# EAGLE design Wino_Adapter_1 (EAGLE 7.5.0)
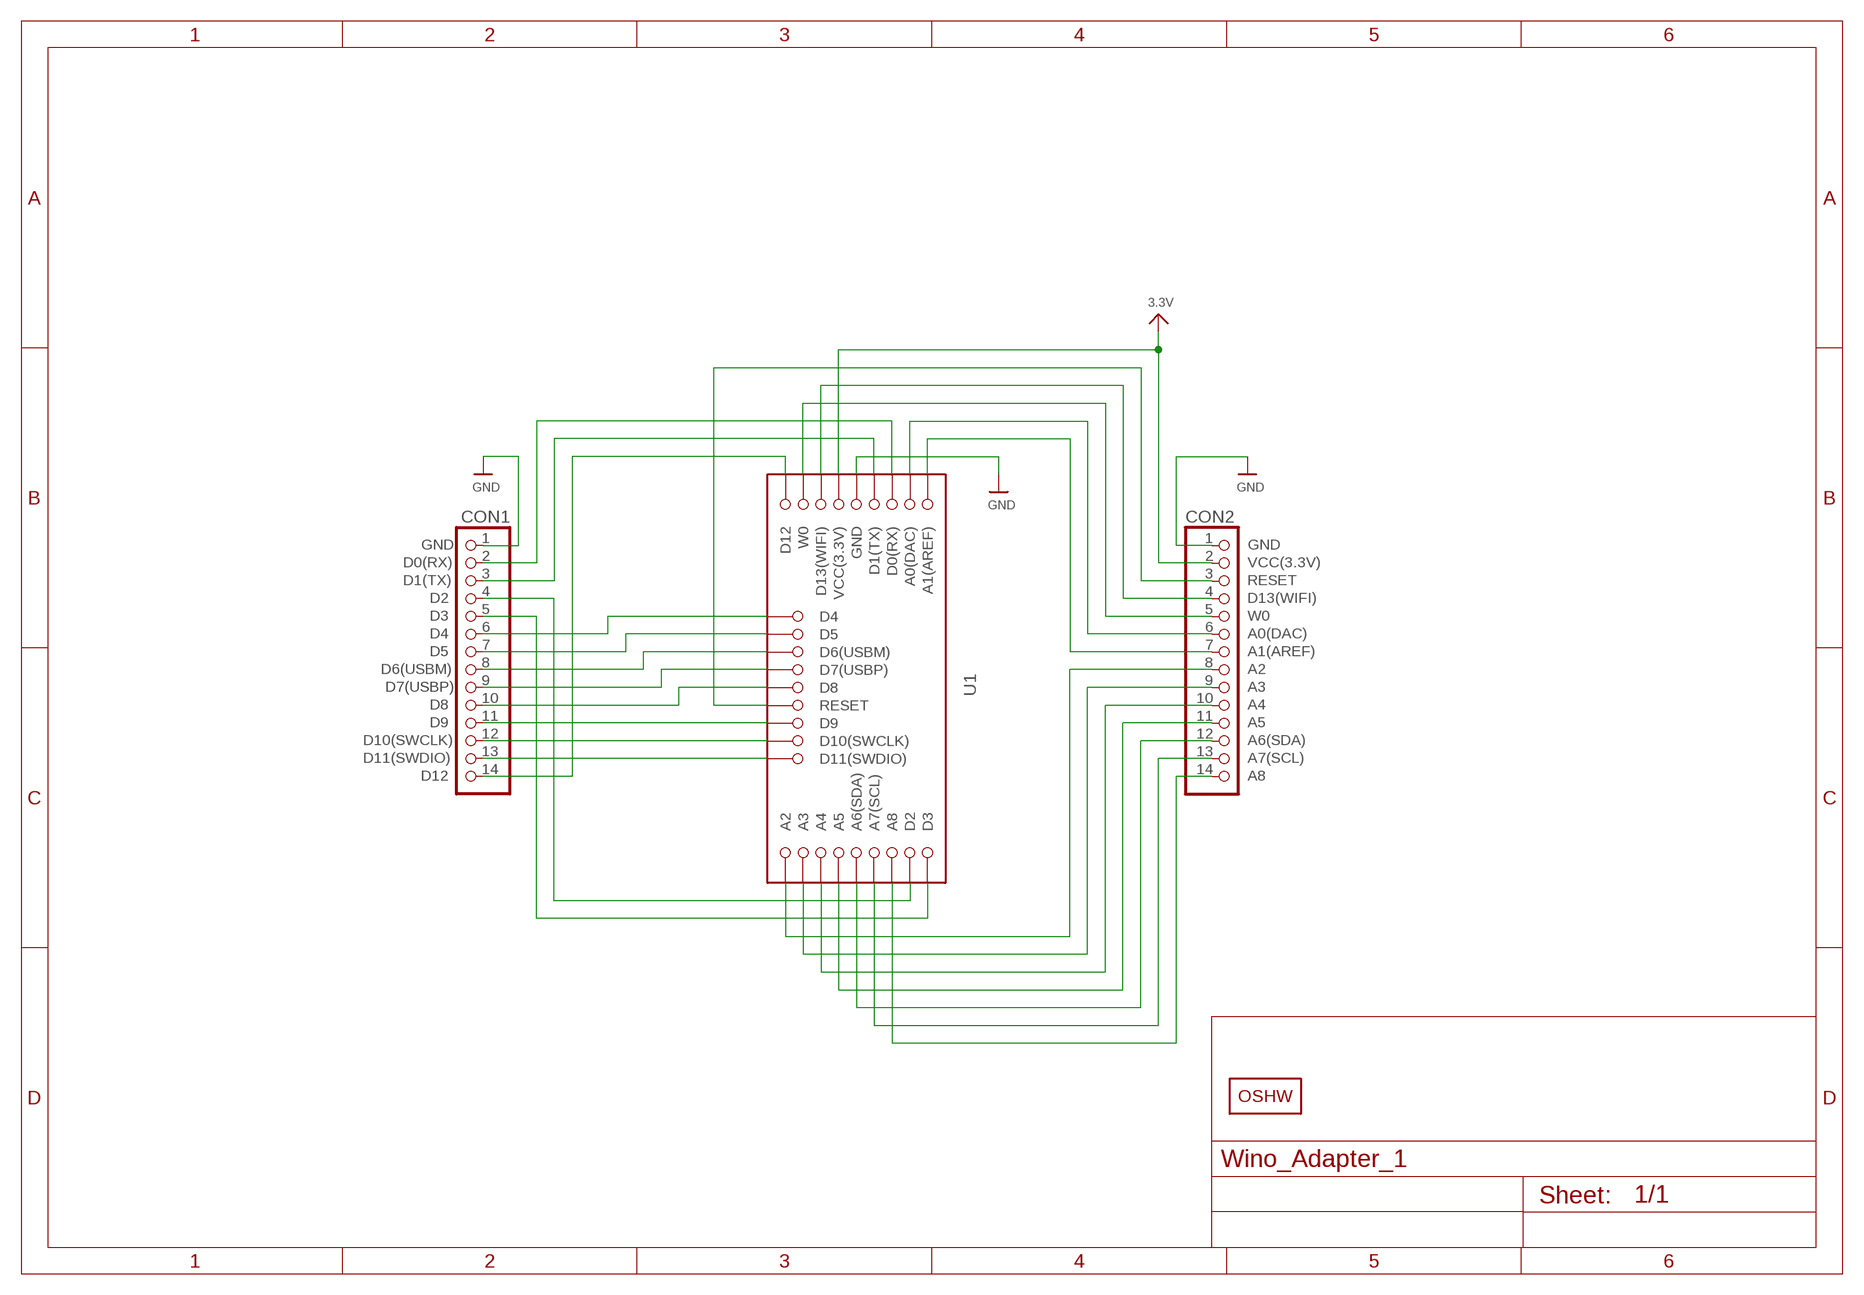
[diagram p0: schematic, sheet 1]

## Parts
CON1  HEADER-1X14  [1X14_ROUND_70]
CON2  HEADER-1X14  [1X14_ROUND_70]
LOGO1  OSHW_LOGOX0150  [OSHW_6X150]
U1  WINO_BOARD_EINLOET  [WINO_BOARD_EINLOET]

## Nets
3.3V: CON2.2 U1.VCC(VCC(3.3V))
GND: CON1.1 CON2.1 U1.GND
N$1: CON1.2 U1.D0(D0(RX))
N$2: CON1.3 U1.D1(D1(TX))
N$3: CON1.4 U1.D2
N$4: CON1.5 U1.D3
N$5: CON1.6 U1.D4
N$6: CON1.7 U1.D5
N$7: CON1.8 U1.D6(D6(USBM))
N$8: CON1.9 U1.D7(D7(USBP))
N$9: CON1.10 U1.D8
N$10: CON1.13 U1.D11(D11(SWDIO))
N$11: CON1.12 U1.D10(D10(SWCLK))
N$12: CON1.11 U1.D9
N$13: CON1.14 U1.D12
N$14: CON2.4 U1.D13(WIFI)
N$15: CON2.6 U1.A0(A0(DAC))
N$16: CON2.7 U1.A1(A1(AREF))
N$17: CON2.8 U1.A2
N$18: CON2.9 U1.A3
N$19: CON2.10 U1.A4
N$20: CON2.11 U1.A5
N$21: CON2.12 U1.A6(A6(SDA))
N$22: CON2.13 U1.A7(A7(SCL))
N$23: CON2.14 U1.A8
N$24: CON2.3 U1.RESET
N$25: CON2.5 U1.W0

## Notes on the sheet
- GND | GND
- D0(RX) | VCC(3.3V)
- D1(TX) | RESET
- D2 | D13(WIFI)
- D3 | W0
- D4 | A0(DAC)
- D5 | A1(AREF)
- D6(USBM) | A2
- D7(USBP) | A3
- D8 | A4
- D9 | A5
- D10(SWCLK) | A6(SDA)
- D11(SWDIO) | A7(SCL)
- D12 | A8

## Library data of the parts
CON1 CON2 = microbuilder:HEADER-1X14
LOGO1 = 00_Dirks:OSHW_LOGO: Open-Source-Hardware Logo
U1 = winoboard_eagle:WINO_BOARD

## Board
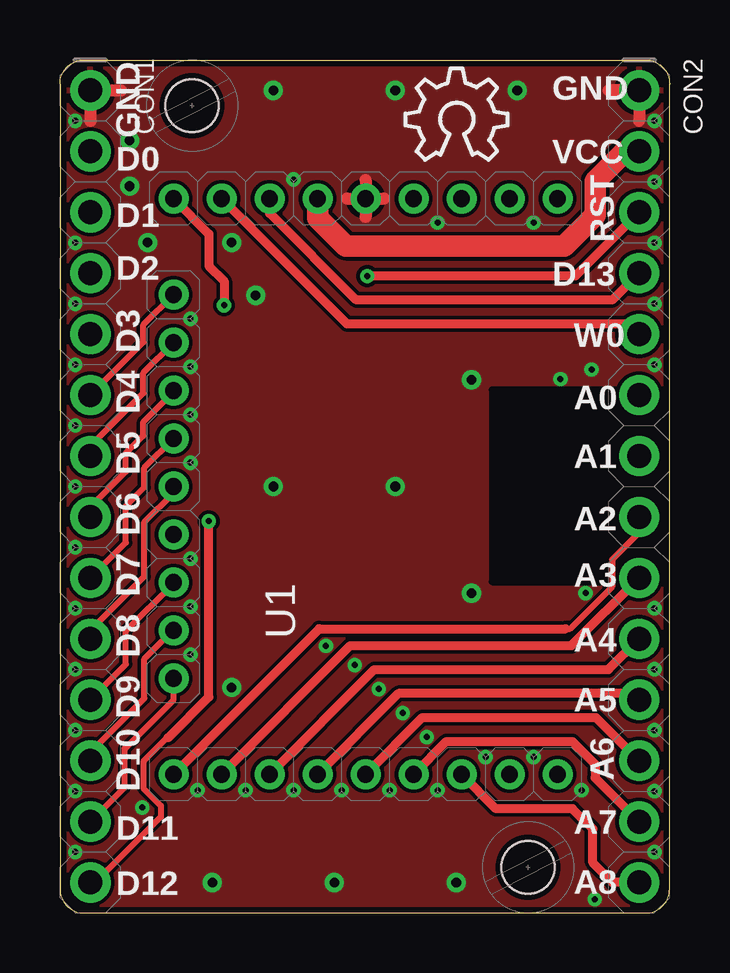
[diagram p1: board, top side]
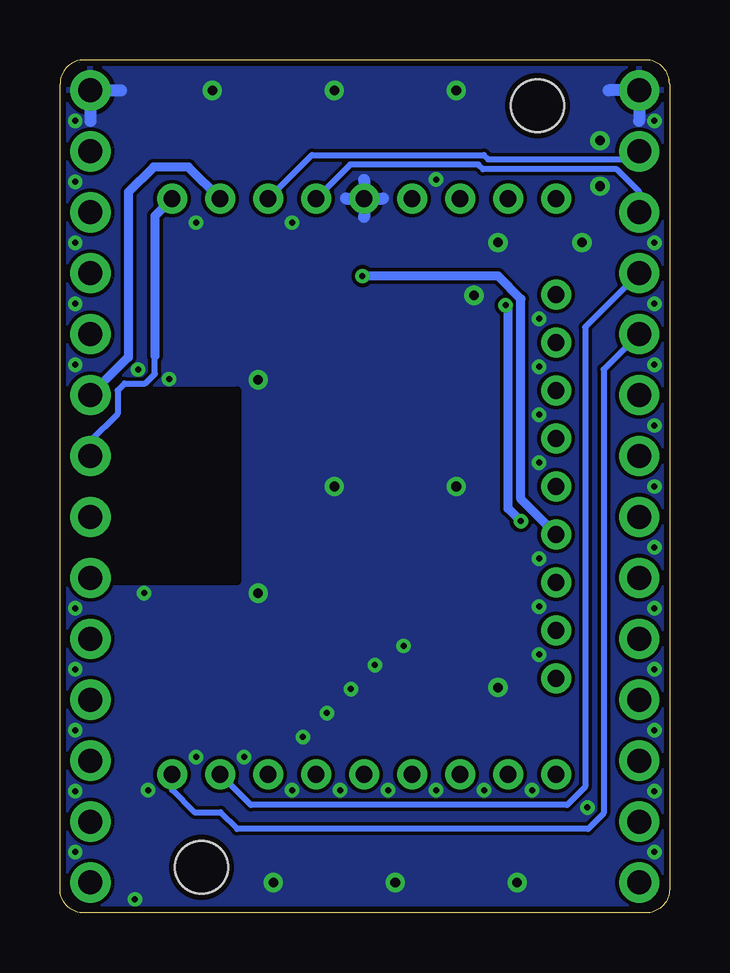
[diagram p2: board, bottom side, seen from below]

Size 25.4 x 35.56 mm. Coordinates in mm from the lower left corner, seen from the top.
Outline: 25.4,1 25.4,34.56 arc90 24.4,35.56 1,35.56 arc90 0,34.56 0,1 arc90 1,0 24.4,0 arc90 25.4,1
Copper layers (1*16): Top 0.018mm / dielectric 1.55mm / Bottom 0.018mm
Design rules "eC_2Layer_PClass6_BaseCopperO18_eCDefault_0.25mm_drills *": minimum track width 0.15mm, minimum drill 0.25mm, track to track 0.15mm, track to pad 0.15mm, pad to pad 0.15mm, via to via 0.15mm, smd to smd 0mil, copper to edge 0.25mm, drill to drill 0.35mm, minimum pad ring 0.175mm, minimum via ring 0.125mm, stop-mask expansion 0mil, vias tented up to drill 0.45mm, thermal gap 0.2mm
Holes 2.2 mm at 5.5,33.65 19.5,1.9
tRestrict: area 18,13.8 to 25.4,21.8
bRestrict: area 18,13.8 to 25.4,21.8

### Footprints (pad centres in the part's own frame; a part is rotated, then mirrored left to right if it is on the bottom)
1X14_ROUND_70 = drill 1 pad 1.676: 1 -16.51,0; 2 -13.97,0; 3 -11.43,0; 4 -8.89,0; 5 -6.35,0; 6 -3.81,0; 7 -1.27,0; 8 1.27,0; 9 3.81,0; 10 6.35,0; 11 8.89,0; 12 11.43,0; 13 13.97,0; 14 16.51,0
WINO_BOARD_EINLOET = drill 0.7 pad 1.25: A0 12,-14; A1 12,-16; A2 -12,0; A3 -12,-2; A4 -12,-4; A5 -12,-6; A6 -12,-8; A7 -12,-10; A8 -12,-12; D0 12,-12; D1 12,-10; D2 -12,-14; D3 -12,-16; D4 8,0; D5 6,0; D6 4,0; D7 2,0; D8 0,0; D9 -4,0; D10 -6,0; D11 -8,0; D12 12,0; D13(WIFI) 12,-4; GND 12,-8; RESET -2,0; VCC 12,-6; W0 12,-2

### Placement (x,y rotation side)
CON1  1.27,17.78 270 top
CON2  24.13,17.78 270 top
LOGO1  14.4,31.4 0 top
U1  4.73,17.78 90 top

### Tracks (layer width: path | path; a pad name or v marks a point on that pad's centre or on a via)
3.3V
  Top 0.9: CON2.2 23.55,31.75 22.3,30.5 22.3,29.1 21,27.8 11.9,27.8 10.73,28.97 U1.VCC
GND  (via drill 0.25 pad 0.6, 0.4 pad 0.8)
  Top 0.5: 2.54,34.29 CON1.1 1.27,33.02 | 22.86,34.29 CON2.1 24.13,33.02 | 12.73,30.55 12.73,29.01 | 11.95,29.78 13.49,29.78
  Bottom 0.5: 2.54,34.29 CON1.1 1.27,33.02 | 22.86,34.29 CON2.1 24.13,33.02 | 13.49,29.78 11.95,29.78 | 12.73,30.55 12.73,29.01
  other vias: 3.42,4.4 0.64,2.54 0.64,5.08 0.64,7.62 0.64,10.16 0.64,12.7 0.64,15.24 0.64,17.78 0.64,20.32 0.64,22.86 0.64,25.4 0.64,27.94 0.64,33.02 24.77,2.54 24.77,5.08 24.77,7.62 24.77,10.16 24.77,12.7 21.9,13.34 22.15,22.66 24.77,22.86 24.77,25.4 24.77,27.94 24.77,30.48 24.77,33.02 3.65,27.95 7.15,27.95 19.73,28.78 15.73,28.78 5.43,10.77 5.43,12.77 5.43,14.77 5.43,18.77 5.43,20.77 5.43,22.77 5.43,24.77 5.73,5.12 7.73,5.12 9.73,5.12 11.73,5.12 13.73,5.12 15.73,5.12 21.73,5.12 7.15,9.4 11.43,1.27 8.89,34.29 13.97,34.29 8.89,17.78 13.97,17.78 19.05,34.29 6.35,1.27 16.51,1.27 17.14,13.34 17.14,22.23 11.08,11.13 22.28,0.57 2.9,32.2 2.9,30.3 20.85,22.26 12.28,10.34 13.28,9.34 14.28,8.34 15.28,7.33 9.73,30.58 8.15,25.75 19.73,6.5 17.73,6.5
  pour Top (isolate 0.15): 0,35.56 25.4,35.56 25.4,0 0,0
  pour Bottom (isolate 0.15): 0,0 0,35.56 25.4,35.56 25.4,0
  pour Top (rank 2, no thermals): 9.9,18.6 13,18.6 13,17.5 13,17 9.9,17
  pour Bottom (rank 2, no thermals): 8.2,14.8 14.1,14.8 14.1,12.7 8.2,12.7
N$1
  Bottom 0.25: U1.D0 14.91,31.6 7.74,31.6 7.56,31.42 1.6,31.42 CON1.2
N$2
  Bottom 0.25: U1.D1 13.31,31.2 7.97,31.2 7.77,31 2.2,31 1.27,30.07 CON1.3
N$3
  Bottom 0.25: U1.D2 17.45,4.5 4.27,4.5 3.52,5.25 3.52,24.42 CON1.4
N$4
  Bottom 0.25: CON1.5 2.75,22.66 2.75,4.16 3.4,3.5 18.02,3.5 18.72,4.2 19.8,4.2 20.73,5.13 U1.D3
N$5
  Top 0.25: U1.D4 3.47,24.52 3.47,23.79 CON1.6
N$6
  Top 0.25: U1.D5 3.47,22.52 3.47,21.67 1.27,19.47 CON1.7
N$7
  Top 0.25: CON1.8 1.27,16.93 2.75,18.4 2.75,19.18 3.47,19.9 3.47,20.47 4.73,21.73 U1.D6
N$8
  Top 0.25: CON1.9 2.75,15.45 2.75,16.98 3.52,17.75 3.52,18.57 U1.D7
N$9
  Top 0.25: CON1.10 1.27,11.77 3.52,14.02 3.52,16.3 4.73,17.51 U1.D8
N$10
  Top 0.25: U1.D11 4.73,8.88 2.69,6.85 2.69,5.24 CON1.13
N$11
  Top 0.25: CON1.12 1.27,6.7 3.52,8.95 3.52,10.6 4.7,11.78 U1.D10
N$12
  Top 0.25: U1.D9 4.73,13.73 2.75,11.75 2.75,10.37 CON1.11
N$13  (via drill 0.25 pad 0.6)
  Top 0.25: CON1.14 1.47,1.27 4.2,4 4.2,4.47 3.47,5.2 3.47,6.32 4.45,7.3 4.5,7.3
  Top 0.37: U1.D12 6.2,28.31 6.2,26.97 6.83,26.34 v6.83,25.34 | 4.5,7.3 6.2,9 v6.2,16.34
  Bottom 0.37: v6.83,25.34 6.72,25.23 6.72,16.86 v6.2,16.34
N$14
  Top 0.37: U1.D13(WIFI) 8.73,29.17 12.35,25.55 23.01,25.55 CON2.4
N$15
  Bottom 0.37: U1.A0 20.05,31.1 21.5,31.1 22.55,30.05 22.55,23.17 CON2.6
N$16
  Bottom 0.25: CON2.7 24.13,19.67 23,20.8 23,21.78 22.7,22.07 21.85,22.07 21.45,22.48 21.45,23.23
  Bottom 0.37: 21.45,23.23 21.45,29.06 U1.A1
N$17
  Top 0.25: CON2.8 24.13,15.86 23,14.73 23,13.6 21.25,11.85 21.07,11.85
  Top 0.37: 21.07,11.85 10.8,11.85 U1.A2
N$18
  Top 0.37: CON2.9 21.31,11.15 12.1,11.15 U1.A3
N$19
  Top 0.37: CON2.10 22.85,10.15 13.1,10.15 U1.A4
N$20
  Top 0.37: CON2.11 23.87,9.15 14.1,9.15 U1.A5
N$21
  Top 0.37: U1.A6 15.1,8.15 22.33,8.15 CON2.12
N$22
  Top 0.37: CON2.13 22.3,5.64 22.3,6.2 21.35,7.15 16.1,7.15 U1.A7
N$23
  Top 0.37: CON2.14 23.03,1.27 22.2,2.1 22.2,3.5 21.35,4.35 18.16,4.35 U1.A8
N$24  (via drill 0.25 pad 0.6)
  Top 0.37: v12.8,26.55 21.47,26.55 CON2.3
  Bottom 0.37: U1.RESET 6.2,17.25 6.2,25.6 7.15,26.55 v12.8,26.55
N$25
  Top 0.37: U1.W0 11.96,24.55 23.71,24.55 CON2.5

### Text on the board
tPlace: GND | GND | D0 | VCC | D1 | RST | D2 | D13 | D3 | W0 | D4 | A0 | D5 | A1 | D6 | A2 | D7 | A3 | D8 | A4 | D9 | D10 | A5 | A6 | D11 | A7 | D12 | A8
tRestrict: TOP
bRestrict: Bottom
tDocu: Mounting Holes (Diam.2,2 mm / for M2): / 14 X 31,75 mm (~ 5,5 X 12,5 inch)